# EasyEDA Pro project ProProject_Stc32f_Car副本_2024-06-03.epro, schematic schematic5
Create Date: 2024-04-24; Page Name: P1; Project Name: Stc32f_Car; Schematic Name: Schematic5; Update Date: 2024-04-24; Company: 嘉立创EDA; Page Size: A4; Version: V1.0
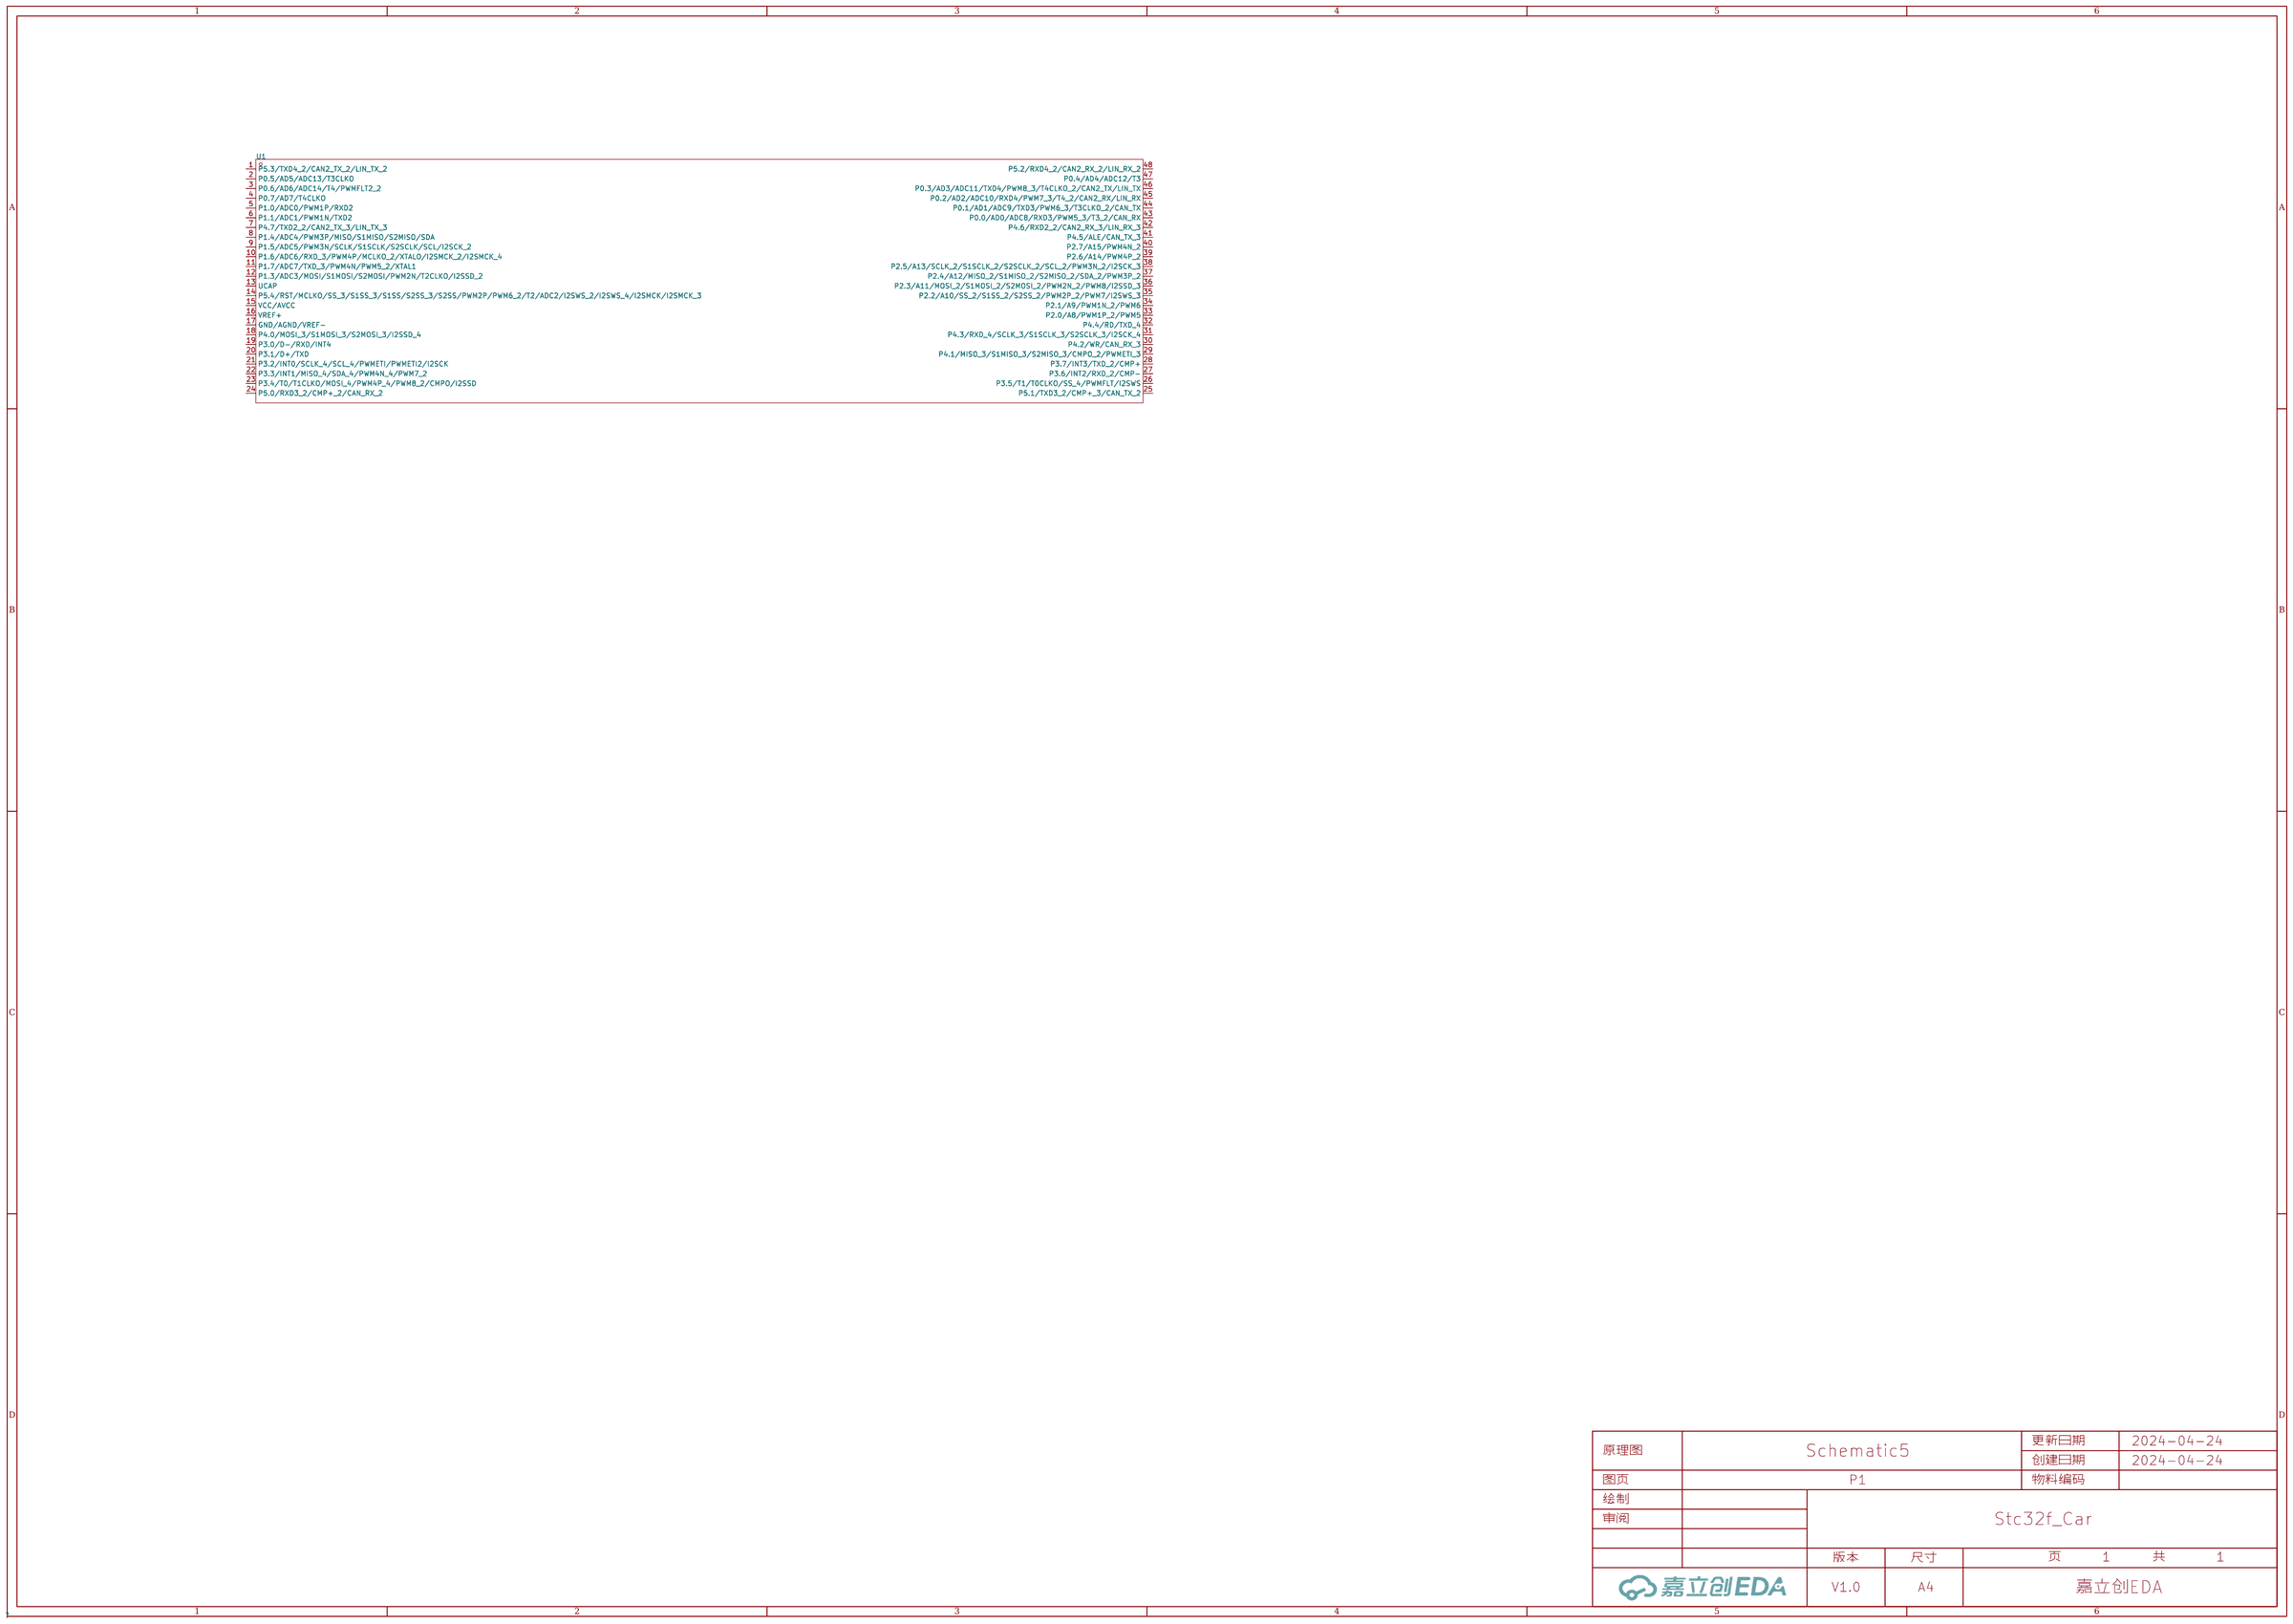
[diagram p3: schematic sheet]

## Parts
U1  STC32F12K54-64I-LQFP48  [LQFP-48_L7.0-W7.0-P0.50-LS9.0-BL]

## Library data of the parts
U1 = STC32F12K54-64I-LQFP48: Supplier Part: C7430197; Manufacturer: STC(宏晶); Supplier Footprint: LQFP-48(7x7); JLCPCB Part Class: 扩展库; Datasheet: https://atta.szlcsc.com/upload/public/pdf/source/20230914/EE84BFAB73746799BFCD977324263BA5.pdf; Supplier: LCSC

## Nets

Not connected (* = marked no-connect by the designer): U1 1(P5.3/TXD4_2/CAN2_TX_2/LIN_TX_2) 2(P0.5/AD5/ADC13/T3CLKO) 3(P0.6/AD6/ADC14/T4/PWMFLT2_2) 4(P0.7/AD7/T4CLKO) 5(P1.0/ADC0/PWM1P/RXD2) 6(P1.1/ADC1/PWM1N/TXD2) 7(P4.7/TXD2_2/CAN2_TX_3/LIN_TX_3) 8(P1.4/ADC4/PWM3P/MISO/S1MISO/S2MISO/SDA) 9(P1.5/ADC5/PWM3N/SCLK/S1SCLK/S2SCLK/SCL/I2SCK_2) 10(P1.6/ADC6/RXD_3/PWM4P/MCLKO_2/XTALO/I2SMCK_2/I2SMCK_4) 11(P1.7/ADC7/TXD_3/PWM4N/PWM5_2/XTAL1) 12(P1.3/ADC3/MOSI/S1MOSI/S2MOSI/PWM2N/T2CLKO/I2SSD_2) 13(UCAP) 14(P5.4/RST/MCLKO/SS_3/S1SS_3/S1SS/S2SS_3/S2SS/PWM2P/PWM6_2/T2/ADC2/I2SWS_2/I2SWS_4/I2SMCK/I2SMCK_3) 15(VCC/AVCC) 16(VREF+) 17(GND/AGND/VREF-) 18(P4.0/MOSI_3/S1MOSI_3/S2MOSI_3/I2SSD_4) 19(P3.0/D-/RXD/INT4) 20(P3.1/D+/TXD) 21(P3.2/INT0/SCLK_4/SCL_4/PWMETI/PWMETI2/I2SCK) 22(P3.3/INT1/MISO_4/SDA_4/PWM4N_4/PWM7_2) 23(P3.4/T0/T1CLKO/MOSI_4/PWM4P_4/PWM8_2/CMPO/I2SSD) 24(P5.0/RXD3_2/CMP+_2/CAN_RX_2) 25(P5.1/TXD3_2/CMP+_3/CAN_TX_2) 26(P3.5/T1/T0CLKO/SS_4/PWMFLT/I2SWS) 27(P3.6/INT2/RXD_2/CMP-) 28(P3.7/INT3/TXD_2/CMP+) 29(P4.1/MISO_3/S1MISO_3/S2MISO_3/CMPO_2/PWMETI_3) 30(P4.2/WR/CAN_RX_3) 31(P4.3/RXD_4/SCLK_3/S1SCLK_3/S2SCLK_3/I2SCK_4) 32(P4.4/RD/TXD_4) 33(P2.0/A8/PWM1P_2/PWM5) 34(P2.1/A9/PWM1N_2/PWM6) 35(P2.2/A10/SS_2/S1SS_2/S2SS_2/PWM2P_2/PWM7/I2SWS_3) 36(P2.3/A11/MOSI_2/S1MOSI_2/S2MOSI_2/PWM2N_2/PWM8/I2SSD_3) 37(P2.4/A12/MISO_2/S1MISO_2/S2MISO_2/SDA_2/PWM3P_2) 38(P2.5/A13/SCLK_2/S1SCLK_2/S2SCLK_2/SCL_2/PWM3N_2/I2SCK_3) 39(P2.6/A14/PWM4P_2) 40(P2.7/A15/PWM4N_2) 41(P4.5/ALE/CAN_TX_3) 42(P4.6/RXD2_2/CAN2_RX_3/LIN_RX_3) 43(P0.0/AD0/ADC8/RXD3/PWM5_3/T3_2/CAN_RX) 44(P0.1/AD1/ADC9/TXD3/PWM6_3/T3CLKO_2/CAN_TX) 45(P0.2/AD2/ADC10/RXD4/PWM7_3/T4_2/CAN2_RX/LIN_RX) 46(P0.3/AD3/ADC11/TXD4/PWM8_3/T4CLKO_2/CAN2_TX/LIN_TX) 47(P0.4/AD4/ADC12/T3) 48(P5.2/RXD4_2/CAN2_RX_2/LIN_RX_2)
